# EAGLE design mood_ring (EAGLE 7.2.0)
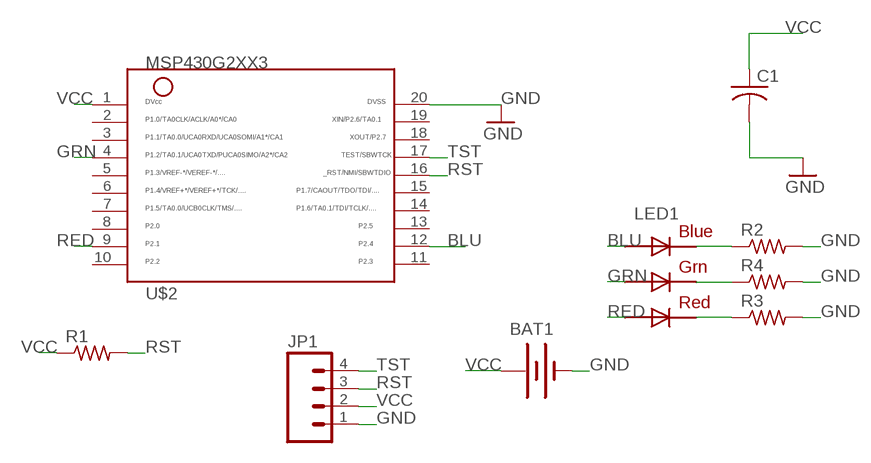
[diagram p0: schematic, sheet 1]

## Parts
BAT1  BATTERYBU2032SM  [BU2032SM]
C1  C-USC1206  [C1206]
JP1  M04LOCK  [1X04_LOCK]
LED1  RGBLED5050  [RGBLED5050]
R1  R-US_R1206  [R1206]
R2  R-US_R1206  [R1206]
R3  R-US_R1206  [R1206]
R4  R-US_R1206  [R1206]
U$2  MSP430G2XX3TSSOP  [PW20]

## Nets
BLU: LED1.3(BLUE_A) U$2.12
GND: BAT1.P$2(-) C1.2 JP1.1 R2.2 R3.2 R4.2 U$2.20
GRN: LED1.1(GREEN_A) U$2.4
N$1: LED1.4(BLUE_C) R2.1
N$2: LED1.5(RED_C) R3.1
N$3: LED1.6(GREEN_C) R4.1
RED: LED1.2(RED_A) U$2.9
RST: JP1.3 R1.2 U$2.16
TST: JP1.4 U$2.17
VCC: BAT1.P$1(+) C1.1 JP1.2 R1.1 U$2.1
Unconnected: U$2.2 U$2.3 U$2.5 U$2.6 U$2.7 U$2.8 U$2.10 U$2.11 U$2.13 U$2.14 U$2.15 U$2.18 U$2.19

## Library data of the parts
BAT1 = ELEC327:BATTERY: Battery Holders Various common sizes : AA, AAA, 20mm coin cell and 12mm coin cell. 20MM_4LEGS, BATT-10373
C1 = resistor:C-US: CAPACITOR, American symbol
JP1 = SparkFun:M04: Header 4 Standard 4-pin 0.1" header. Use with straight break away headers (SKU : PRT-00116), right angle break away headers (PRT-00553), swiss pins (PRT-00743), machine pins (PRT-00117), and female headers (PRT-00115). Molex polarized connector foot print use with SKU : PRT-08231 with associated crimp pins and housings.
LED1 = adafruit:RGBLED: For 5050 RGB LEDs, the order of the LEDs may vary from one manufacturer to another!
R1-R4 = resistor:R-US_: RESISTOR, American symbol
U$2 = ELEC327:MSP430G2XX3: MSP430G2XX3 PDIP (N) 20 Pin Package

## Board
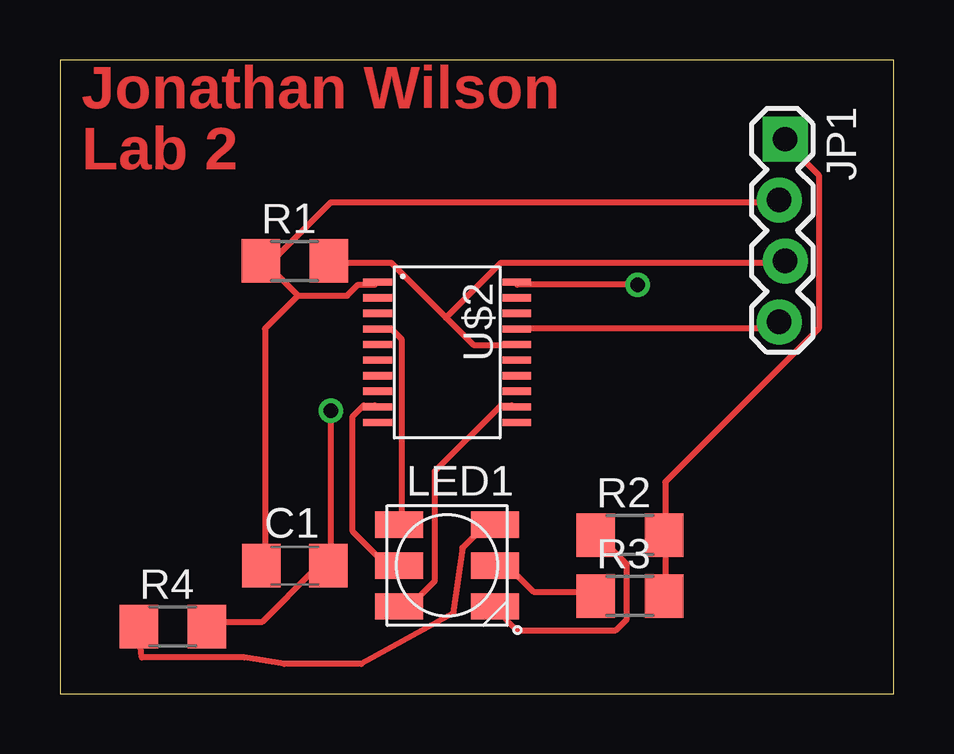
[diagram p1: board, top side]
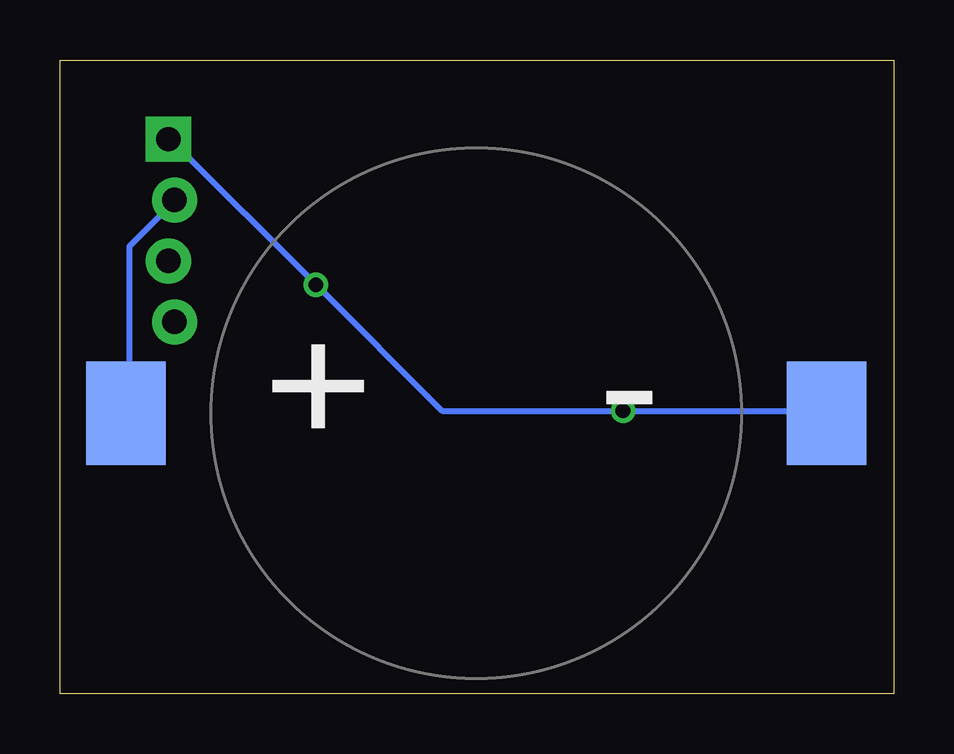
[diagram p2: board, bottom side, seen from below]

Size 34.76 x 26.43 mm. Coordinates in mm from the lower left corner, seen from the top.
Outline: 0,0 34.76,0 34.76,26.43 0,26.43 0,0
Copper layers (1*16): Top 0.035mm / dielectric 1.5mm / Bottom 0.035mm
Design rules "default": minimum track width 10mil, minimum drill 24mil, track to track 8mil, track to pad 8mil, pad to pad 8mil, via to via 8mil, smd to smd 8mil, copper to edge 40mil, drill to drill 8mil, minimum pad ring 10mil, minimum via ring 8mil, stop-mask expansion 4mil, vias tented up to drill 0mil, thermal gap 10mil

### Footprints (pad centres in the part's own frame; a part is rotated, then mirrored left to right if it is on the bottom)
BU2032SM = smd 3.302 x 4.318: P$1 -14.605,0; P$2 14.605,0
C1206 = smd 1.6 x 1.8: 1 -1.4,0; 2 1.4,0
1X04_LOCK = drill 1.016 pad 1.88 square: 1 0,0.127 | drill 1.016 pad 1.88: 2 2.54,-0.127; 3 5.08,0.127; 4 7.62,-0.127
RGBLED5050 = smd 2 x 1.1: 1 -2,1.7; 2 -2,0; 3 -2,-1.7; 4 2,-1.7; 5 2,0; 6 2,1.7
R1206 = smd 1.6 x 1.803: 1 -1.422,0; 2 1.422,0
PW20 = smd 0.3 x 1.2: 1 -2.925,-2.9; 2 -2.275,-2.9; 3 -1.625,-2.9; 4 -0.975,-2.9; 5 -0.325,-2.9; 6 0.325,-2.9; 7 0.975,-2.9; 8 1.625,-2.9; 9 2.275,-2.9; 10 2.925,-2.9; 11 2.925,2.9; 12 2.275,2.9; 13 1.625,2.9; 14 0.975,2.9; 15 0.325,2.9; 16 -0.325,2.9; 17 -0.975,2.9; 18 -1.625,2.9; 19 -2.275,2.9; 20 -2.925,2.9

### Placement (x,y rotation side)
BAT1  17.41,11.7 0 bottom
C1  9.79,5.35 0 top
JP1  30.11,23.13 270 top
LED1  16.14,5.35 0 top
R1  9.79,18.05 0 top
R2  23.76,6.62 0 top
R3  23.76,4.08 0 top
R4  4.71,2.81 0 top
U$2  16.14,14.24 270 top

### Tracks (layer width: path | path; a pad name or v marks a point on that pad's centre or on a via)
BLU
  Top 0.254: U$2.12 18.83,12.03 18.38,12.03 15.63,9.29 15.63,4.71 14.72,3.8 14.26,3.8 LED1.3
GND  (via drill 0.61)
  Top 0.254: R4.2 6.16,3.01 8.44,3.01 10.6,5.17 11.06,5.17 C1.2 11.29,5.4 v11.29,11.8 | R3.2 25.23,4.26 25.23,6.54 R2.2 25.23,6.77 25.23,8.83 31.63,15.23 31.63,21.63 30.26,23 JP1.1 | v24.09,17.06 19.06,17.06 U$2.20
  Bottom 0.254: JP1.1 30.03,23 v24.09,17.06 18.83,11.8 v11.29,11.8 2.83,11.8 BAT1.P$2
GRN
  Top 0.254: U$2.4 13.35,15.23 13.8,15.23 14.26,14.77 14.26,7.23 LED1.1
N$1
  Top 0.254: R2.1 22.49,6.54 23.63,5.4 23.63,3.12 23.18,2.66 19.06,2.66 18.15,3.57 LED1.4
N$2
  Top 0.254: R3.1 22.26,4.26 19.75,4.26 18.83,5.17 18.15,5.17 LED1.5
N$3
  Top 0.254: R4.1 3.41,1.51 7.68,1.51 9.35,1.24 12.56,1.24 16.38,3.36 16.78,6.09 17.92,7.23 LED1.6
RED
  Top 0.254: U$2.9 13.12,12.03 12.66,12.03 12.2,11.57 12.2,6.77 13.57,5.4 14.03,5.4 LED1.2
RST
  Top 0.254: 16.09,15.69 13.8,17.97 11.29,17.97 R1.2 | 16.09,15.69 17.23,14.54 18.83,14.54 U$2.16 | 16.09,15.69 18.38,17.97 30.03,17.97 JP1.3
TST
  Top 0.254: U$2.17 19.06,15.23 29.58,15.23 29.8,15.46 JP1.4
VCC
  Top 0.254: 9.92,16.6 11.97,16.6 12.43,17.06 13.12,17.06 U$2.1 | 9.92,16.6 8.54,17.97 R1.1 8.54,18.2 9,18.2 11.29,20.49 29.8,20.49 JP1.2 | 9.92,16.6 8.54,15.23 8.54,5.4 C1.1
  Bottom 0.254: JP1.2 30.03,20.49 31.86,18.66 31.86,11.8 BAT1.P$1

### Text on the board
Top: Jonathan Wilson | Lab 2